# Altium schematic sheet DDR3_TERMINATION.SchDoc
size A3
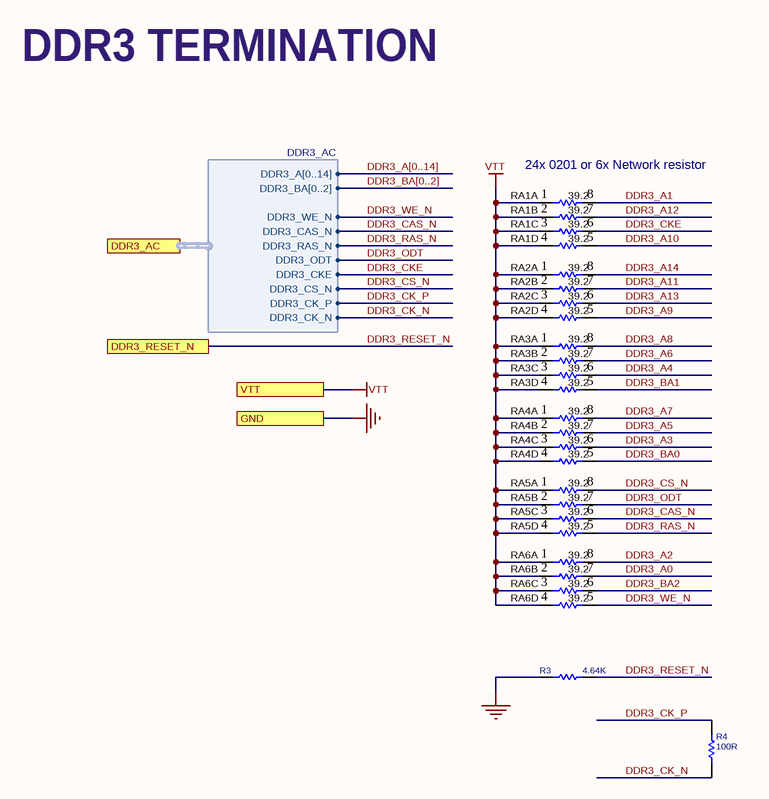
[diagram p0: DDR3_TERMINATION.SchDoc]

## Parts
R3  4.64K  [R0402A]
R4  100R  [R0402A]
RA1  value 39.2  [RP0402X4A]  (hidden comment: Film Res Pack)  (parts A,B,C,D of 4)
RA2  value 39.2  [RP0402X4A]  (hidden comment: Film Res Pack)  (parts A,B,C,D of 4)
RA3  value 39.2  [RP0402X4A]  (hidden comment: Film Res Pack)  (parts A,B,C,D of 4)
RA4  value 39.2  [RP0402X4A]  (hidden comment: Film Res Pack)  (parts A,B,C,D of 4)
RA5  value 39.2  [RP0402X4A]  (hidden comment: Film Res Pack)  (parts A,B,C,D of 4)
RA6  value 39.2  [RP0402X4A]  (hidden comment: Film Res Pack)  (parts A,B,C,D of 4)

## Ports
DDR3_AC (harness DDR3_AC), DDR3_RESET_N, GND, VTT

## Harnesses
DDR3_AC: DDR3_A[0..14], DDR3_BA[0..2], DDR3_WE_N, DDR3_CAS_N, DDR3_RAS_N, DDR3_ODT, DDR3_CKE, DDR3_CS_N, DDR3_CK_P, DDR3_CK_N

## Nets
GND: R3.2 ; port GND
VTT: RA1.1 RA1.2 RA1.3 RA1.4 RA2.1 RA2.2 RA2.3 RA2.4 RA3.1 RA3.2 RA3.3 RA3.4 RA4.1 RA4.2 RA4.3 RA4.4 RA5.1 RA5.2 RA5.3 RA5.4 RA6.1 RA6.2 RA6.3 RA6.4 ; port VTT
DDR3_A0: RA6.7
DDR3_A1: RA1.8
DDR3_A2: RA6.8
DDR3_A3: RA4.6
DDR3_A4: RA3.6
DDR3_A5: RA4.7
DDR3_A6: RA3.7
DDR3_A7: RA4.8
DDR3_A8: RA3.8
DDR3_A9: RA2.5
DDR3_A10: RA1.5
DDR3_A11: RA2.7
DDR3_A12: RA1.7
DDR3_A13: RA2.6
DDR3_A14: RA2.8
DDR3_BA0: RA4.5
DDR3_BA1: RA3.5
DDR3_BA2: RA6.6
DDR3_CAS_N: RA5.6 ; port DDR3_AC.DDR3_CAS_N
DDR3_CK_N: R4.1 ; port DDR3_AC.DDR3_CK_N
DDR3_CK_P: R4.2 ; port DDR3_AC.DDR3_CK_P
DDR3_CKE: RA1.6 ; port DDR3_AC.DDR3_CKE
DDR3_CS_N: RA5.8 ; port DDR3_AC.DDR3_CS_N
DDR3_ODT: RA5.7 ; port DDR3_AC.DDR3_ODT
DDR3_RAS_N: RA5.5 ; port DDR3_AC.DDR3_RAS_N
DDR3_RESET_N: R3.1 ; port DDR3_RESET_N
DDR3_WE_N: RA6.5 ; port DDR3_AC.DDR3_WE_N

## Buses and harness runs
bus DDR3_A[0..14]
bus DDR3_BA[0..2]

## Notes on the sheet
- DDR3 TERMINATION
- (near RA1) 24x 0201 or 6x Network resistor
- Title
- Size:
- Date:
- File:
- A1
- Number:
- Time:
- Revision:
- Sheet
- of

## Library data of the parts
R3 = RES_SMD: RESISTOR, SMD; MANF: Yageo; PARAM: 0.063W; DESC: DESCRIPTION; DIST#: MOUSER; PARAM2: 1%; MANF_P#: RC0402FR-074K7L; ASSEMBLY: ASSEMBLY; PRICE: 100= 0.3$; VALUE: 4.64K
R4 = RES_SMD: RESISTOR, SMD; MANF: Yageo; PARAM: 0.063W; DESC: DESCRIPTION; DIST#: MOUSER; PARAM2: 1%; MANF_P#: RC0402FR-13100RL; ASSEMBLY: ASSEMBLY; PRICE: 100= 0.3$; VALUE: 100R
RA1-RA6 = RES_SMD_PACK_X4: RESISTOR, SMD, PACKX4; MANF_P#: 4D02WGF392JTCE; MANF: MANF